# EAGLE schematic bandpass 40m (EAGLE 9.1.2)
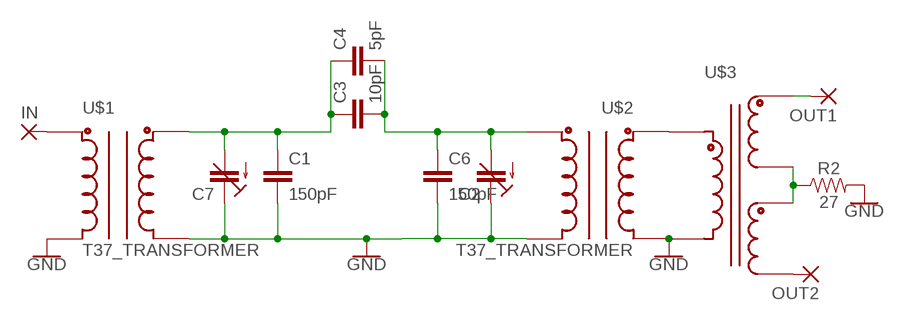
[diagram p0: schematic, sheet 1]

## Parts
C1  150pF  C5/3.5  [C5B3.5]
C2  C-TRIMMTZ03  [CTRIMTZ03]
C3  10pF  C5/3.5  [C5B3.5]
C4  5pF  C5/3.5  [C5B3.5]
C6  150pF  C5/3.5  [C5B3.5]
C7  C-TRIMMTZ03  [CTRIMTZ03]
IN  3,17/1,1  [3,17/1,1]
OUT1  3,17/1,1  [3,17/1,1]
OUT2  3,17/1,1  [3,17/1,1]
R2  27  1KOHM-HORIZ-1/4W-1%  [AXIAL-0.3]
U$1  T37_TRANSFORMER  [T37_TRANSFORMER]
U$2  T37_TRANSFORMER  [T37_TRANSFORMER]
U$3  T50_SPLITTER  [T50_SPLITTER]

## Nets
GND: C1.2 C2.1(E) C6.2 C7.1(E) R2.P$2 U$1.C1A U$1.C2A U$2.C1A U$2.C2A U$3.C1A
N$1: C1.1 C3.1 C4.1 C7.2(A) U$1.C2B
N$2: IN.1(P) U$1.C1B
N$3: C2.2(A) C3.2 C4.2 C6.1 U$2.C2B
N$4: U$2.C1B U$3.C1B
N$5: OUT1.1(P) U$3.C3B(C2B)
N$6: R2.P$1 U$3.C2A(C3B) U$3.C3A(C2A)
N$7: OUT2.1(P) U$3.C2B(C3A)

## Library data of the parts
C1 C3 C4 C6 = capacitor-wima:C: CAPACITOR naming: grid - package width
C2 C7 = resistor:C-TRIMM: Trimm capacitor
IN OUT1 OUT2 = wirepad:3,17/1,1: THROUGH-HOLE PAD
R2 = SparkFun-Resistors:1KOHM: 1kΩ resistor A resistor is a passive two-terminal electrical component that implements electrical resistance as a circuit element. Resistors act to reduce current flow, and, at the same time, act to lower voltage levels within circuits. - Wikipedia; PROD_ID: RES-12182; VALUE: 1k
U$1 U$2 = toroid:T37_TRANSFORMER: Transformer wound on a T37 Toroid
U$3 = toroid:T50_SPLITTER: Transformer (having 3 windings) on a T50 Toroid

## Net classes
0 default: width 0.762 mm, drill 0.762 mm, clearance 0.508 mm